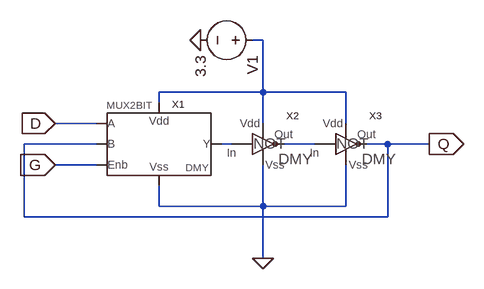
[diagram p0: schematic D-Latch.asc]
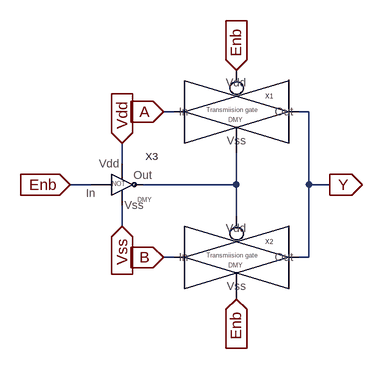
[diagram p1: sub-circuit mux2-1.asc]
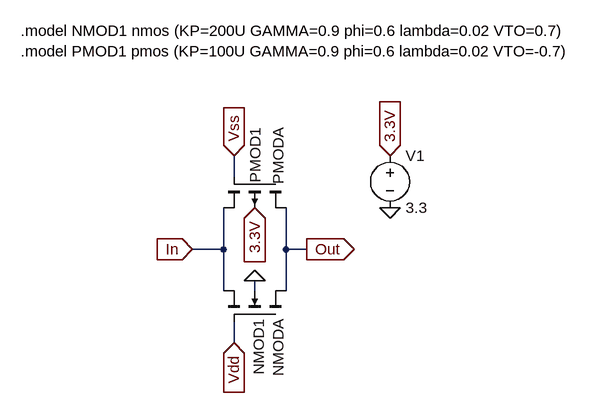
[diagram p2: sub-circuit transmissiongate.asc]
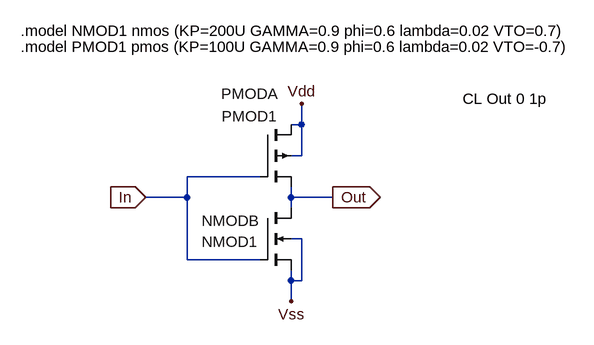
[diagram p3: sub-circuit not.asc]
D-Latch.asc, the LTspice schematic file:
Version 4
SHEET 1 880 680
WIRE 400 16 384 16
WIRE 400 96 400 16
WIRE 400 96 240 96
WIRE 528 96 400 96
WIRE 240 112 240 96
WIRE 144 144 80 144
WIRE 400 144 400 96
WIRE 528 144 528 96
WIRE 144 176 32 176
WIRE 352 176 336 176
WIRE 480 176 432 176
WIRE 592 176 560 176
WIRE 656 176 592 176
WIRE 144 208 80 208
WIRE 240 272 240 240
WIRE 400 272 400 208
WIRE 400 272 240 272
WIRE 528 272 528 208
WIRE 528 272 400 272
WIRE 32 288 32 176
WIRE 592 288 592 176
WIRE 592 288 32 288
WIRE 400 352 400 272
FLAG 656 176 Q
IOPIN 656 176 Out
FLAG 80 144 D
IOPIN 80 144 In
FLAG 80 208 G
IOPIN 80 208 In
FLAG 400 352 0
FLAG 304 16 0
SYMBOL MUX2-1 256 176 R0
SYMATTR InstName X1
SYMBOL NOT 384 176 R0
SYMATTR InstName X2
SYMBOL NOT 512 176 R0
SYMATTR InstName X3
SYMBOL voltage 400 16 R90
WINDOW 123 0 0 Left 0
WINDOW 39 0 0 Left 0
SYMATTR InstName V1
SYMATTR Value 3.3

mux2-1.asc, the sub-circuit schematic file:
Version 4
SHEET 1 880 680
WIRE 96 112 80 112
WIRE 304 112 288 112
WIRE 16 192 16 160
WIRE -32 224 -64 224
WIRE 192 224 192 176
WIRE 192 224 48 224
WIRE 304 224 304 112
WIRE 336 224 304 224
WIRE 192 272 192 224
WIRE 16 288 16 256
WIRE 96 336 80 336
WIRE 304 336 304 224
WIRE 304 336 288 336
FLAG -64 224 Enb
IOPIN -64 224 In
FLAG 80 112 A
IOPIN 80 112 In
FLAG 80 336 B
IOPIN 80 336 In
FLAG 192 400 Enb
IOPIN 192 400 In
FLAG 192 48 Enb
IOPIN 192 48 In
FLAG 336 224 Y
IOPIN 336 224 Out
FLAG 16 160 Vdd
IOPIN 16 160 In
FLAG 16 288 Vss
IOPIN 16 288 In
SYMBOL TransmissionGate 176 112 R0
SYMATTR InstName X1
SYMBOL TransmissionGate 176 336 R0
SYMATTR InstName X2
SYMBOL NOT 0 224 R0
SYMATTR InstName X3

transmissiongate.asc, the sub-circuit schematic file:
Version 4
SHEET 1 1240 680
WIRE 160 144 160 112
WIRE 144 256 144 192
WIRE 144 256 96 256
WIRE 240 256 240 192
WIRE 272 256 240 256
WIRE 144 320 144 256
WIRE 192 320 192 304
WIRE 240 320 240 256
WIRE 160 400 160 368
FLAG 96 256 In
IOPIN 96 256 In
FLAG 272 256 Out
IOPIN 272 256 Out
FLAG 160 112 Vss
IOPIN 160 112 In
FLAG 160 400 Vdd
IOPIN 160 400 In
FLAG 192 192 3.3V
IOPIN 192 192 In
FLAG 192 304 0
FLAG 400 192 0
FLAG 400 112 3.3V
IOPIN 400 112 In
SYMBOL pmos4 240 144 R90
WINDOW 0 -76 12 Left 2
WINDOW 3 -76 47 Left 2
SYMATTR InstName PMODA
SYMATTR Value PMOD1
SYMATTR Value2 l=1u w=50u
SYMBOL nmos4 240 368 M270
WINDOW 0 -83 12 Left 2
WINDOW 3 -81 42 Left 2
SYMATTR InstName NMODA
SYMATTR Value NMOD1
SYMATTR Value2 l=1u w=50u
SYMBOL voltage 400 96 R0
WINDOW 123 0 0 Left 0
WINDOW 39 0 0 Left 0
SYMATTR InstName V1
SYMATTR Value 3.3
TEXT -168 -80 Left 2 !.model NMOD1 nmos (KP=200U GAMMA=0.9 phi=0.6 lambda=0.02 VTO=0.7)\n.model PMOD1 pmos (KP=100U GAMMA=0.9 phi=0.6 lambda=0.02 VTO=-0.7)

not.asc, the sub-circuit schematic file:
Version 4
SHEET 1 880 680
WIRE 288 -96 288 -128
WIRE 288 -96 272 -96
WIRE 288 -48 288 -96
WIRE 288 -48 272 -48
WIRE 224 -16 112 -16
WIRE 112 16 112 -16
WIRE 112 16 48 16
WIRE 272 16 272 0
WIRE 336 16 272 16
WIRE 272 32 272 16
WIRE 112 112 112 16
WIRE 288 80 272 80
WIRE 224 112 112 112
WIRE 272 144 272 128
WIRE 288 144 288 80
WIRE 288 144 272 144
WIRE 272 176 272 144
FLAG 48 16 In
IOPIN 48 16 In
FLAG 336 16 Out
IOPIN 336 16 Out
FLAG 272 176 Vss
FLAG 288 -128 Vdd
SYMBOL pmos4 224 -96 R0
WINDOW 0 -60 -47 Left 2
WINDOW 3 -59 -13 Left 2
SYMATTR InstName PMODA
SYMATTR Value PMOD1
SYMATTR Value2 l=1u w=50u
SYMBOL nmos4 224 32 R0
WINDOW 0 -90 20 Left 2
WINDOW 3 -90 52 Left 2
SYMATTR InstName NMODB
SYMATTR Value NMOD1
SYMATTR Value2 l=1u w=100u
TEXT -144 -240 Left 2 !.model NMOD1 nmos (KP=200U GAMMA=0.9 phi=0.6 lambda=0.02 VTO=0.7)
TEXT -144 -216 Left 2 !.model PMOD1 pmos (KP=100U GAMMA=0.9 phi=0.6 lambda=0.02 VTO=-0.7)
TEXT 536 -136 Left 2 !CL Out 0 1p

The netlist it stands for:
* D-Latch.asc
XX1 D Q G N001 0 N002 mux2-1
XX2 N001 0 N002 N003 not
XX3 N001 0 N003 Q not
V1 N001 0 3.3

* block symbol definitions
.subckt mux2-1 A B Enb Vdd Vss Y
XX1 Enb N001 Y A transmissiongate
XX2 N001 Enb Y B transmissiongate
XX3 Vdd Vss Enb N001 not
.ends mux2-1

.subckt transmissiongate Vdd Vss Out In
M§PMODA Out Vss In 3.3V PMOD1 l=1u w=50u
M§NMODA Out Vdd In 0 NMOD1 l=1u w=50u
V1 3.3V 0 3.3
.model NMOD1 nmos (KP=200U GAMMA=0.9 phi=0.6 lambda=0.02 VTO=0.7)
.model PMOD1 pmos (KP=100U GAMMA=0.9 phi=0.6 lambda=0.02 VTO=-0.7)
.ends transmissiongate

.subckt not Vdd Vss In Out
M§PMODA Vdd In Out Vdd PMOD1 l=1u w=50u
M§NMODB Out In Vss Vss NMOD1 l=1u w=100u
.model NMOD1 nmos (KP=200U GAMMA=0.9 phi=0.6 lambda=0.02 VTO=0.7)
.model PMOD1 pmos (KP=100U GAMMA=0.9 phi=0.6 lambda=0.02 VTO=-0.7)
CL Out 0 1p
.ends not

.model NMOS NMOS
.model PMOS PMOS
.lib standard.mos
.backanno
.end